# EAGLE schematic 32u4 board (EAGLE 7.0.0)
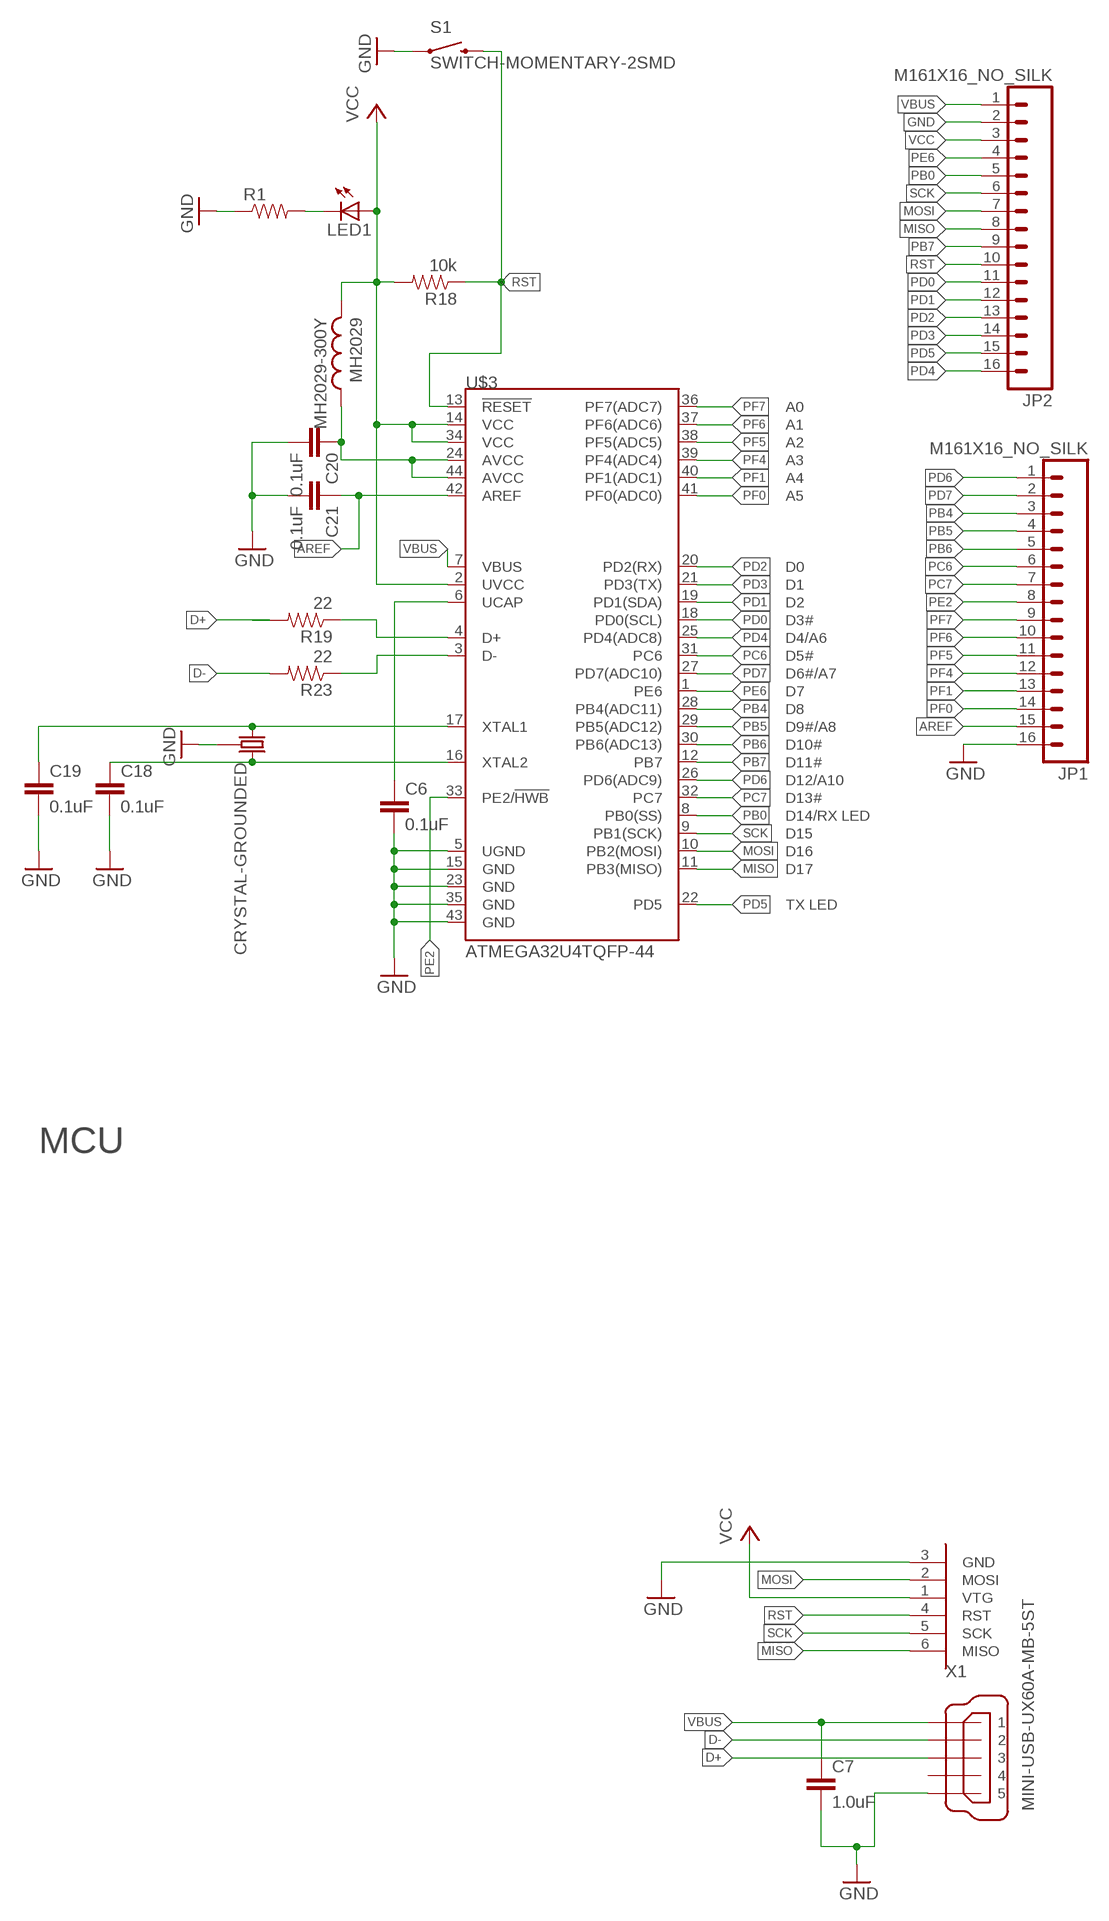
[diagram p0: schematic, sheet 1]

## Parts
C6  0.1uF  0.1UF-25V(+80/-20%)(0603)  [0603-CAP]
C7  1.0uF  1.0UF-16V-10%(0603)  [0603-CAP]
C18  0.1uF  0.1UF-25V(+80/-20%)(0603)  [0603-CAP]
C19  0.1uF  0.1UF-25V(+80/-20%)(0603)  [0603-CAP]
C20  0.1uF  0.1UF-25V(+80/-20%)(0603)  [0603-CAP]
C21  0.1uF  0.1UF-25V(+80/-20%)(0603)  [0603-CAP]
JP1  M161X16_NO_SILK  [1X16_NO_SILK]
JP2  M161X16_NO_SILK  [1X16_NO_SILK]
LED1  LEDCHIPLED_0603  [CHIPLED_0603]
MH2029  MH2029-300Y  L-USL2012C  [L2012C]
R1  RESISTOR0603  [0603-RES]
R18  10k  RESISTOR0603-RES  [0603-RES]
R19  22  RESISTOR0603-RES  [0603-RES]
R23  22  RESISTOR0603-RES  [0603-RES]
S1  SWITCH-MOMENTARY-2SMD  [TACTILE_SWITCH_SMD]
U$2  ICSP_SMD  [ICSP]
U$3  ATMEGA32U4TQFP-44  [TQFP44]
U$4  CRYSTAL-GROUNDED  [CRYSTAL-SMD-5X3]
X1  MINI-USB-UX60A-MB-5ST  [UX60A-MB-5ST]

## Nets
AREF: C21.1 JP1.15 U$3.42(AREF)
D+: R19.2 X1.3
D-: R23.2 X1.2
GND: C6.2 C7.2 C18.2 C19.2 C20.2 C21.2 JP1.16 JP2.2 R1.1 S1.1 U$2.3(GND) U$3.5(UGND) U$3.15(GND) U$3.23(GND) U$3.35(GND) U$3.43(GND) U$4.2 U$4.4 X1.5
MISO: JP2.8 U$2.6(MISO) U$3.11(PB3(MISO))
MOSI: JP2.7 U$2.2(MOSI) U$3.10(PB2(MOSI))
N$1: LED1.C R1.2
N$23: R19.1 U$3.4(D+)
N$24: R23.1 U$3.3(D-)
N$27: C6.1 U$3.6(UCAP)
N$31: C20.1 MH2029.1 U$3.24(AVCC) U$3.44(AVCC)
N$39: C19.1 U$3.17(XTAL1) U$4.3
N$41: C18.1 U$3.16(XTAL2) U$4.1
PB0: JP2.5 U$3.8(PB0(SS))
PB4: JP1.3 U$3.28(PB4(ADC11))
PB5: JP1.4 U$3.29(PB5(ADC12))
PB6: JP1.5 U$3.30(PB6(ADC13))
PB7: JP2.9 U$3.12(PB7)
PC6: JP1.6 U$3.31(PC6)
PC7: JP1.7 U$3.32(PC7)
PD0: JP2.11 U$3.18(PD0(SCL))
PD1: JP2.12 U$3.19(PD1(SDA))
PD2: JP2.13 U$3.20(PD2(RX))
PD3: JP2.14 U$3.21(PD3(TX))
PD4: JP2.16 U$3.25(PD4(ADC8))
PD5: JP2.15 U$3.22(PD5)
PD6: JP1.1 U$3.26(PD6(ADC9))
PD7: JP1.2 U$3.27(PD7(ADC10))
PE2: JP1.8 U$3.33(PE2/!HWB)
PE6: JP2.4 U$3.1(PE6)
PF0: JP1.14 U$3.41(PF0(ADC0))
PF1: JP1.13 U$3.40(PF1(ADC1))
PF4: JP1.12 U$3.39(PF4(ADC4))
PF5: JP1.11 U$3.38(PF5(ADC5))
PF6: JP1.10 U$3.37(PF6(ADC6))
PF7: JP1.9 U$3.36(PF7(ADC7))
RST: JP2.10 R18.1 S1.3 U$2.4(RST) U$3.13(!RESET)
SCK: JP2.6 U$2.5(SCK) U$3.9(PB1(SCK))
VBUS: C7.1 JP2.1 U$3.7(VBUS) X1.1
VCC: JP2.3 LED1.A MH2029.2 R18.2 U$2.1(VTG) U$3.2(UVCC) U$3.14(VCC) U$3.34(VCC)
Unconnected: X1.4

## Notes on the sheet
- MCU

## Library data of the parts
C6 C18-C21 = SparkFun-Capacitors:0.1UF-25V(+80/-20%)(0603): Ceramic Standard decoupling cap CAP-00810; PROD_ID: CAP-00810
C7 = SparkFun-Capacitors:1.0UF-16V-10%(0603): CAP-00868; PROD_ID: CAP-00868
JP1 JP2 = SparkFun-Connectors:M16: 1x16 .1" header
LED1 = adafruit:LED: LED OSRAM: - CHIPLED LG R971, LG N971, LY N971, LG Q971, LY Q971, LO R971, LY R971 LH N974, LH R974 LS Q976, LO Q976, LY Q976 LO Q996 - Hyper CHIPLED LW Q18S LB Q993, LB Q99A, LB R99A - SideLED LS A670, LO A670, LY A670, LG A670, LP A670 LB A673, LV A673, LT A673, LW A673 LH A674 LY A675 LS A676, LA A676, LO A676, LY A676, LW A676 LS A679, LY A679, LG A679 - Hyper Micro SIDELED® LS Y876, LA Y876, LO Y876, LY Y876 LT Y87S - SmartLED LW L88C, LW L88S LB L89C, LB L89S, LG L890 LS L89K, LO L89K, LY L89K LS L896, LA L896, LO L896, LY L896 - TOPLED LS T670, LO T670, LY T670, LG T670, LP T670 LSG T670, LSP T670, LSY T670, LOP T670, LYG T670 LG T671, LOG T671, LSG T671 LB T673, LV T673, LT T673, LW T673 LH T674 LS T676, LA T676, LO T676, LY T676, LB T676, LH T676, LSB T676, LW T676 LB T67C, LV T67C, LT T67C, LS T67K, LO T67K, LY T67K, LW E67C LS E67B, LA E67B, LO E67B, LY E67B, LB E67C, LV E67C, LT E67C LW T67C LS T679, LY T679, LG T679 LS T770, LO T770, LY T770, LG T770, LP T770 LB T773, LV T773, LT T773, LW T773 LH T774 LS E675, LA E675, LY E675, LS T675 LS T776, LA T776, LO T776, LY T776, LB T776 LHGB T686 LT T68C, LB T68C - Hyper Mini TOPLED® LB M676 - Mini TOPLED Santana® LG M470 LS M47K, LO M47K, LY M47K Source: http://www.osram.convergy.de/
MH2029 = resistor:L-US: INDUCTOR, American symbol
R1 = SparkFun-Resistors:RESISTOR: Resistor Basic schematic elements and footprints for 0603, 1206, and PTH resistors.
R18 R19 R23 = SparkFun-Passives:RESISTOR: Resistor Basic schematic elements and footprints for 0603, 1206, and PTH resistors.
S1 = SparkFun-Electromechanical:SWITCH-MOMENTARY-2: Various NO switches- pushbuttons, reed, etc
U$2 = Jake:ICSP_SMD
U$3 = SparkFun-DigitalIC:ATMEGA32U4: Atmel 44-pin 8-bit Microcontroller with 32KBytes of ISP Flash and USB Controller
U$4 = SparkFun-FreqCtrl:CRYSTAL-GROUNDED
X1 = con-hirose:MINI-USB-: MINI USB Connector Source: http://www.hirose.co.jp/cataloge_hp/e24000019.pdf; OC_FARNELL: unknown; OC_NEWARK: unknown